# EAGLE design schmitt-trigger (EAGLE 7.6.0)
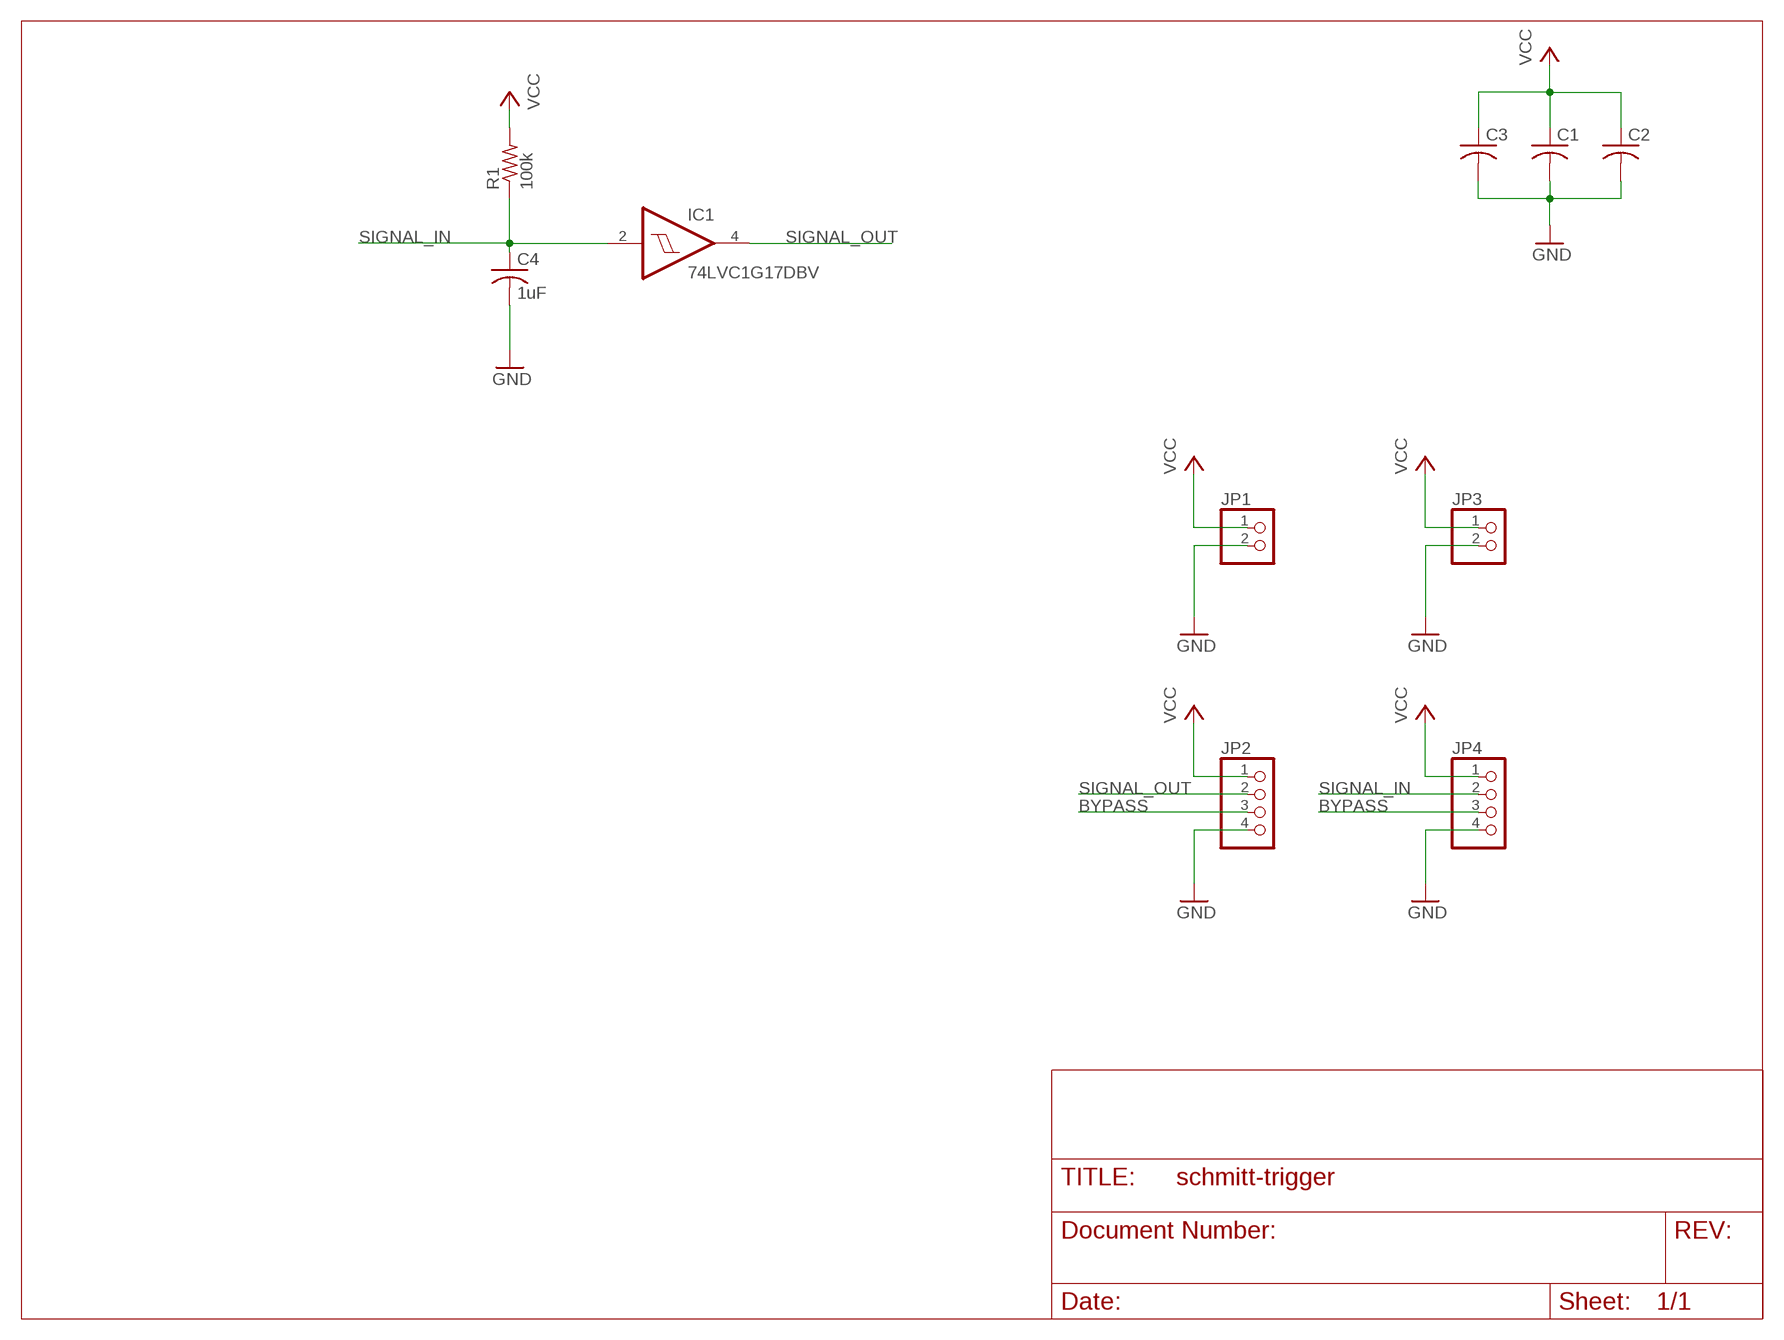
[diagram p0: schematic, sheet 1]

## Parts
C1  C-USC0603K  [C0603K]
C2  C-USC0603K  [C0603K]
C3  C-USC0603K  [C0603K]
C4  1uF  C-USC0603K  [C0603K]
IC1  74LVC1G17DBV  [SOT23-5]
JP1  PINHD-1X2  [1X02]
JP2  PINHD-1X4  [1X04]
JP3  PINHD-1X2  [1X02]
JP4  PINHD-1X4  [1X04]
R1  100k  R-US_R0603  [R0603]

## Nets
BYPASS: JP2.3 JP4.3
GND: C1.2 C2.2 C3.2 C4.2 JP1.2 JP2.4 JP3.2 JP4.4
SIGNAL_IN: C4.1 IC1.2(I) JP4.2 R1.1
SIGNAL_OUT: IC1.4(O) JP2.2
VCC: C1.1 C2.1 C3.1 JP1.1 JP2.1 JP3.1 JP4.1 R1.2

## Power pins joined to a net without a drawn wire
GND: IC1.3(GND)
VCC: IC1.5(VCC)

## Library data of the parts
C1-C4 = resistor:C-US: CAPACITOR, American symbol
IC1 = 74xx-little-us:74*1G17: Single Schmitt-Trigger Buffer
JP1 JP3 = pinhead:PINHD-1X2: PIN HEADER
JP2 JP4 = pinhead:PINHD-1X4: PIN HEADER
R1 = resistor:R-US_: RESISTOR, American symbol

## Board
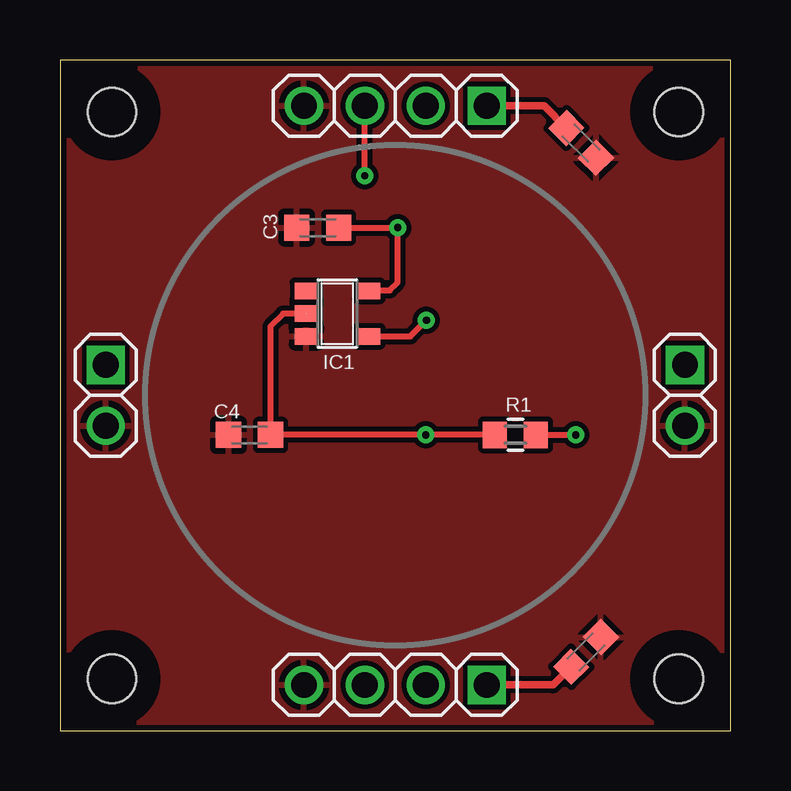
[diagram p1: board, top side]
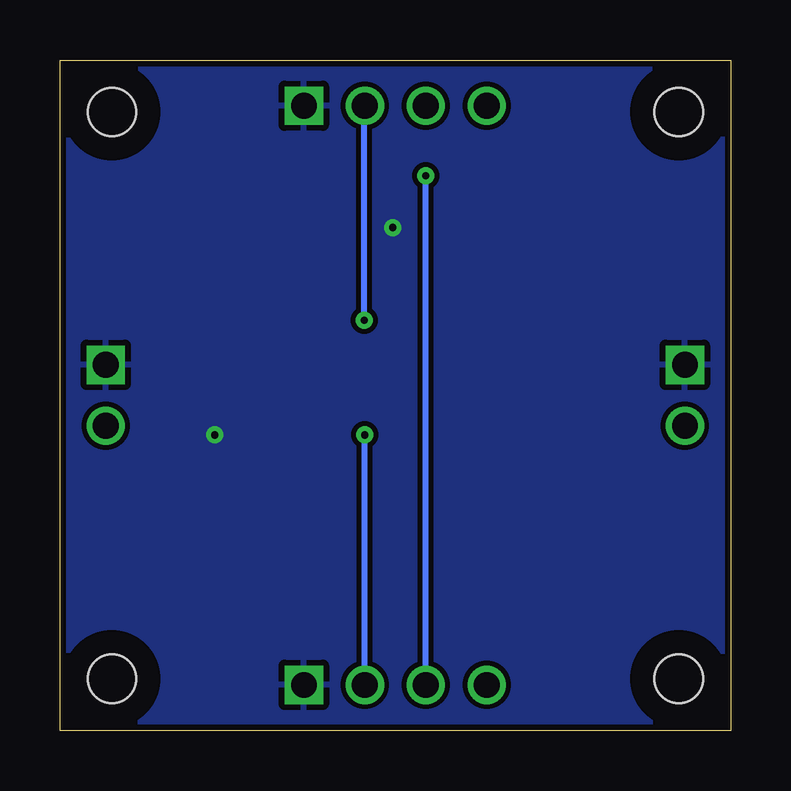
[diagram p2: board, bottom side, seen from below]

Size 27.94 x 27.94 mm. Coordinates in mm from the lower left corner, seen from the top.
Outline: 27.94,27.94 0,27.94 0,0 27.94,0 27.94,27.94
Copper layers (1*16): Top 0.035mm / dielectric 1.5mm / Bottom 0.035mm
Design rules "default *": minimum track width 8mil, minimum drill 12mil, track to track 8mil, track to pad 10mil, pad to pad 10mil, via to via 8mil, smd to smd 8mil, copper to edge 10mil, drill to drill 8mil, minimum pad ring 10mil, minimum via ring 8mil, stop-mask expansion 4mil, vias tented up to drill 0mil, thermal gap 10mil
Holes 2.01 mm at 2.16,2.16 25.78,2.16 25.78,25.78 2.16,25.78
tRestrict: area 23.8,0.2 to 27.8,4.2; area 23.8,23.8 to 27.8,27.8; area 0.2,23.8 to 4.2,27.8; area 0.2,0.2 to 4.2,4.2
bRestrict: area 23.8,0.2 to 27.8,4.2; area 23.8,23.8 to 27.8,27.8; area 0.2,23.8 to 4.2,27.8; area 0.2,0.2 to 4.2,4.2

### Footprints (pad centres in the part's own frame; a part is rotated, then mirrored left to right if it is on the bottom)
C0603K = smd 1.05 x 1.08: 1 -0.875,0; 2 0.875,0
SOT23-5 = smd 0.69 x 0.99: 1 -0.95,-1.29; 2 0,-1.29; 3 0.95,-1.29; 4 0.95,1.3; 5 -0.95,1.3
1X02 = drill 1.067 square: 1 -1.27,0 | drill 1.067: 2 1.27,0
1X04 = drill 1.067 square: 1 -3.81,0 | drill 1.067: 2 -1.27,0; 3 1.27,0; 4 3.81,0
R0603 = smd 1 x 1.1: 1 -0.85,0; 2 0.85,0

### Placement (x,y rotation side)
C1  21.72,24.49 315 top
C2  21.92,3.28 45 top
C3  10.74,20.95 180 top
C4  7.9,12.32 180 top
IC1  11.56,17.37 270 top
JP1  1.91,13.97 270 top
JP2  13.97,26.04 180 top
JP3  26.04,13.97 270 top
JP4  13.97,1.91 180 top
R1  18.97,12.32 0 top

### Tracks (layer width: path | path; a pad name or v marks a point on that pad's centre or on a via)
BYPASS  (via drill 0.3)
  Top 0.254: v12.7,23.11 JP2.3
  Bottom 0.254: JP4.3 v12.7,23.11
GND
  pour Top (rank 6): 27.69,0.25 0.25,0.25 0.25,27.69 27.69,27.69
SIGNAL_IN  (via drill 0.3)
  Top 0.254: IC1.2 9.3,17.37 8.76,16.84 C4.1 v15.24,12.32 R1.1
  Bottom 0.254: JP4.2 v15.24,12.32
SIGNAL_OUT  (via drill 0.3)
  Top 0.254: IC1.4 14.6,16.42 v15.27,17.09
  Bottom 0.254: v15.27,17.09 15.27,26.01 JP2.2
VCC  (via drill 0.3)
  Top 0.254: IC1.5 12.88,18.34 13.75,18.34 14.07,18.67 v14.07,20.95 C3.1 | R1.2 v21.49,12.32
  Top 0.305: C2.1 20.55,1.91 JP4.1 | C1.1 20.17,26.04 JP2.1
  pour Bottom: 27.69,0.25 0.25,0.25 0.25,27.69 27.69,27.69

### Text on the board
Document: OUT | SCHMITT-TRIGGER BOARD | IN